# EAGLE design 006P-5V-3V3Supply (EAGLE 7.2.0)
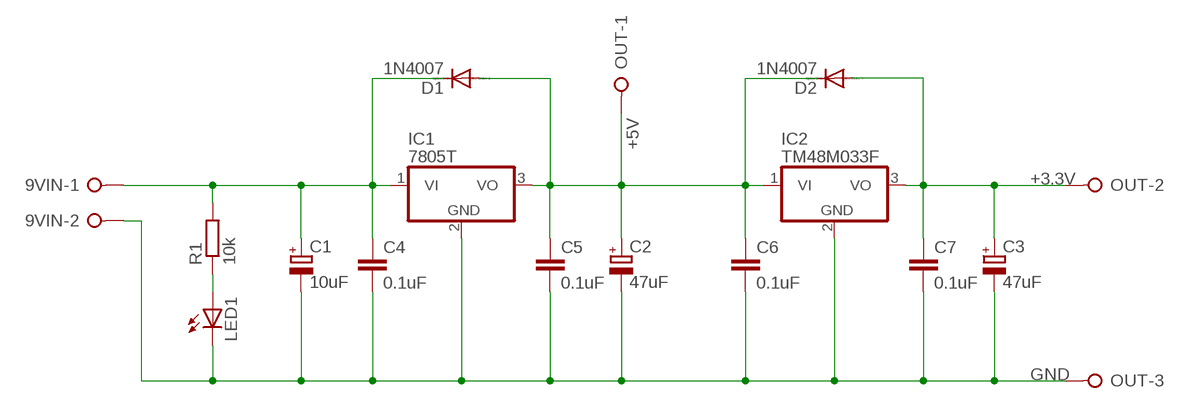
[diagram p0: schematic, sheet 1]

## Parts
9VIN  W237-02P  [W237-132]
C1  10uF  CPOL-EUTT2D4L  [TT2D4L]
C2  47uF  CPOL-EUTT2D5L  [TT2D5L]
C3  47uF  CPOL-EUTT2D5L  [TT2D5L]
C4  0.1uF  C-EU025-024X044  [C025-024X044]
C5  0.1uF  C-EU025-024X044  [C025-024X044]
C6  0.1uF  C-EU025-024X044  [C025-024X044]
C7  0.1uF  C-EU025-024X044  [C025-024X044]
D1  1N4007  1N4004  [DO41-10]
D2  1N4007  1N4004  [DO41-10]
IC1  7805T  [TO220H]
IC2  TM48M033F  7805TV  [TO220V]
LED1  LED3MM  [LED3MM]
OUT  W237-03P  [W237-133]
R1  10k  R-EU_0207/7  [0207/7]

## Nets
+3.3V: C3.+ C7.1 D2.A IC2.3(VO) OUT.2
+5V: C2.+ C5.1 C6.1 D1.A D2.C IC1.3(VO) IC2.1(VI) OUT.1
GND: 9VIN.2 C1.- C2.- C3.- C4.2 C5.2 C6.2 C7.2 IC1.2(GND) IC2.2(GND) LED1.K(C) OUT.3
IN9V: 9VIN.1 C1.+ C4.1 D1.C IC1.1(VI) R1.2
N$1: LED1.A R1.1

## Library data of the parts
9VIN = con-wago-508:W237-02P: WAGO SREW CLAMP; OC_FARNELL: unknown; OC_NEWARK: unknown
C1-C3 = rcl:CPOL-EU: POLARIZED CAPACITOR, European symbol
C4-C7 = rcl:C-EU: CAPACITOR, European symbol
D1 D2 = diode:1N4004: DIODE general purpose rectifier, 1 A
IC1 IC2 = linear:78*: Positive VOLTAGE REGULATOR Source: http://cache.national.com/ds/LM/LM78L05.pdf http://www.fairchildsemi.com/ds/LM/LM7805.pdf
LED1 = led:LED: LED OSRAM: - CHIPLED LG R971, LG N971, LY N971, LG Q971, LY Q971, LO R971, LY R971 LH N974, LH R974 LS Q976, LO Q976, LY Q976 LO Q996 - Hyper CHIPLED LW Q18S LB Q993, LB Q99A, LB R99A - SideLED LS A670, LO A670, LY A670, LG A670, LP A670 LB A673, LV A673, LT A673, LW A673 LH A674 LY A675 LS A676, LA A676, LO A676, LY A676, LW A676 LS A679, LY A679, LG A679 - Hyper Micro SIDELED® LS Y876, LA Y876, LO Y876, LY Y876 LT Y87S - SmartLED LW L88C, LW L88S LB L89C, LB L89S, LG L890 LS L89K, LO L89K, LY L89K LS L896, LA L896, LO L896, LY L896 - TOPLED LS T670, LO T670, LY T670, LG T670, LP T670 LSG T670, LSP T670, LSY T670, LOP T670, LYG T670 LG T671, LOG T671, LSG T671 LB T673, LV T673, LT T673, LW T673 LH T674 LS T676, LA T676, LO T676, LY T676, LB T676, LH T676, LSB T676, LW T676 LB T67C, LV T67C, LT T67C, LS T67K, LO T67K, LY T67K, LW E67C LS E67B, LA E67B, LO E67B, LY E67B, LB E67C, LV E67C, LT E67C LW T67C LS T679, LY T679, LG T679 LS T770, LO T770, LY T770, LG T770, LP T770 LB T773, LV T773, LT T773, LW T773 LH T774 LS E675, LA E675, LY E675, LS T675 LS T776, LA T776, LO T776, LY T776, LB T776 LHGB T686 LT T68C, LB T68C - Hyper Mini TOPLED® LB M676 - Mini TOPLED Santana® LG M470 LS M47K, LO M47K, LY M47K Source: http://www.osram.convergy.de LUXEON: - LUMILED® LXK2-PW12-R00, LXK2-PW12-S00, LXK2-PW14-U00, LXK2-PW14-V00 LXK2-PM12-R00, LXK2-PM12-S00, LXK2-PM14-U00 LXK2-PE12-Q00, LXK2-PE12-R00, LXK2-PE12-S00, LXK2-PE14-T00, LXK2-PE14-U00 LXK2-PB12-K00, LXK2-PB12-L00, LXK2-PB12-M00, LXK2-PB14-N00, LXK2-PB14-P00, LXK2-PB14-Q00 LXK2-PR12-L00, LXK2-PR12-M00, LXK2-PR14-Q00, LXK2-PR14-R00 LXK2-PD12-Q00, LXK2-PD12-R00, LXK2-PD12-S00 LXK2-PH12-R00, LXK2-PH12-S00 LXK2-PL12-P00, LXK2-PL12-Q00, LXK2-PL12-R00 Source: www.luxeon.com KINGBRIGHT: KA-3528ASYC Source: www.kingbright.com
OUT = con-wago-508:W237-03P: WAGO SREW CLAMP; OC_FARNELL: unknown; OC_NEWARK: unknown
R1 = rcl:R-EU_: RESISTOR, European symbol

## Board
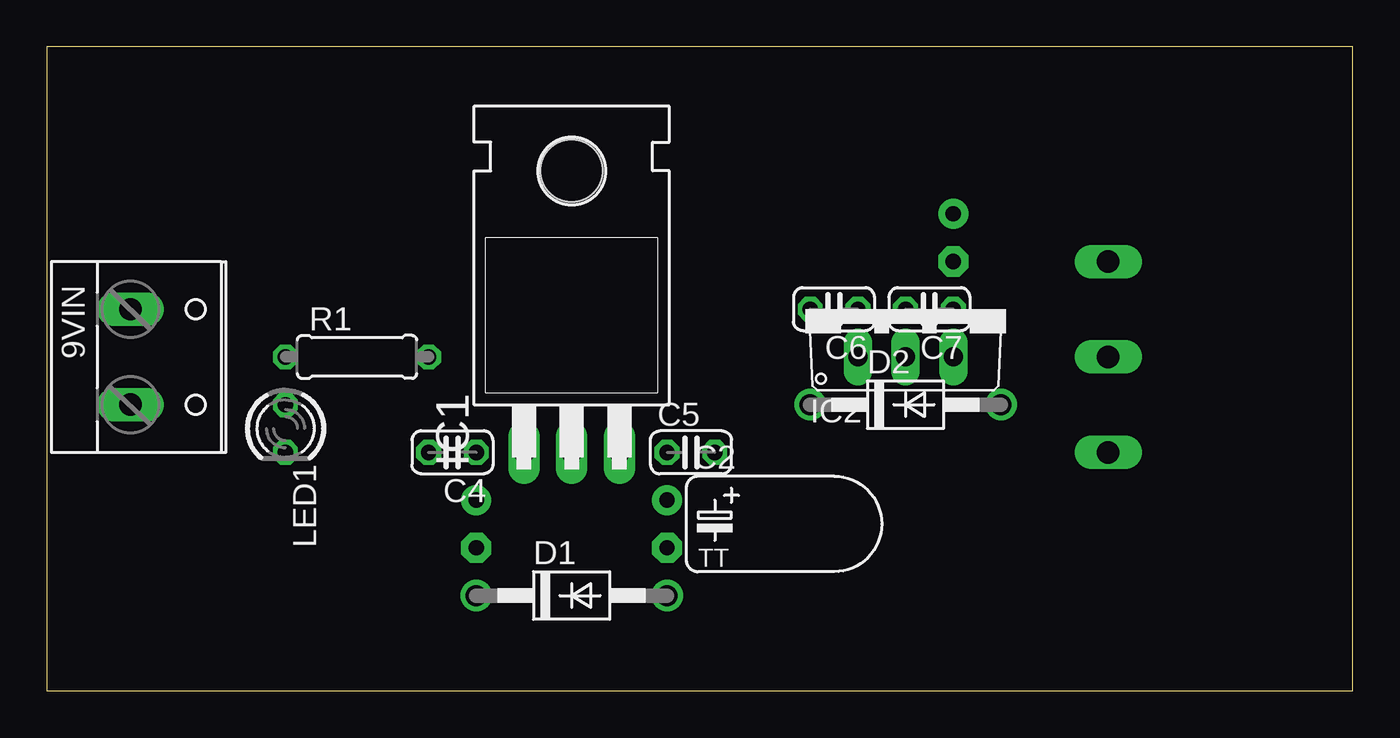
[diagram p1: board, top side]
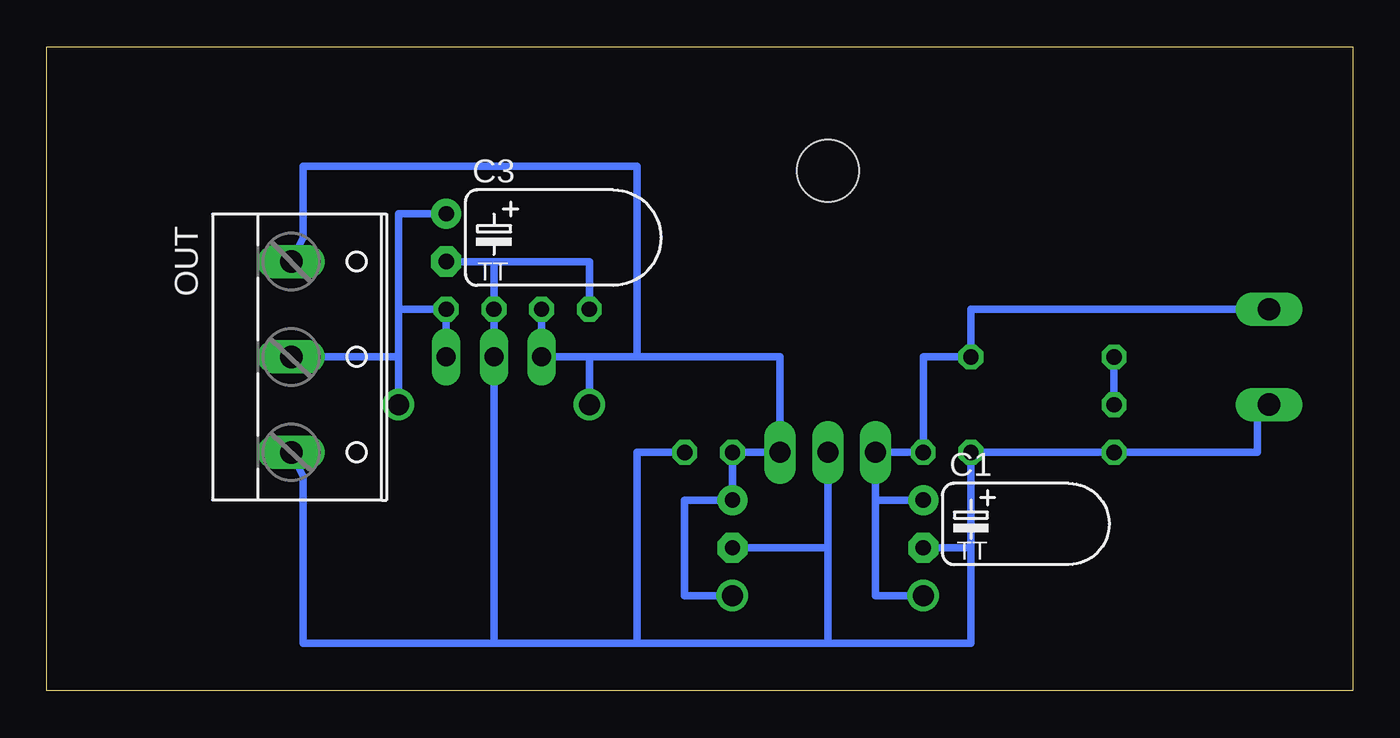
[diagram p2: board, bottom side, seen from below]

Size 69.52 x 34.28 mm. Coordinates in mm from the lower left corner, seen from the top.
Outline: 0,0 69.52,0 69.52,34.28 0,34.28 0,0
Copper layers (1*16): Top 0.035mm / dielectric 1.5mm / Bottom 0.035mm
Design rules "default": minimum track width 10mil, minimum drill 24mil, track to track 8mil, track to pad 8mil, pad to pad 8mil, via to via 8mil, smd to smd 8mil, copper to edge 40mil, drill to drill 8mil, minimum pad ring 10mil, minimum via ring 8mil, stop-mask expansion 4mil, vias tented up to drill 0mil, thermal gap 10mil

### Footprints (pad centres in the part's own frame; a part is rotated, then mirrored left to right if it is on the bottom)
W237-132 = drill 1.194 long: 1 -2.54,-0.635; 2 2.54,-0.635
TT2D4L = drill 0.813 pad 1.6: + -1.27,0 | drill 0.813 pad 1.6 octagon: - 1.27,0
TT2D5L = drill 0.813 pad 1.6: + -1.27,0 | drill 0.813 pad 1.6 octagon: - 1.27,0
C025-024X044 = drill 0.813 octagon: 1 -1.27,0; 2 1.27,0
DO41-10 = drill 1.118: A 5.08,0; C -5.08,0
TO220H = drill 1.118 long: 1 -2.54,-10.16; 2 0,-10.16; 3 2.54,-10.16 | hole 3.302: 0,4.826
TO220V = drill 1.016 long: 1 -2.54,-2.54; 2 0,-2.54; 3 2.54,-2.54
LED3MM = drill 0.813 octagon: A -1.27,0; K 1.27,0
W237-133 = drill 1.194 long: 1 -5.08,-0.635; 2 0,-0.635; 3 5.08,-0.635
0207/7 = drill 0.813 octagon: 1 -3.81,0; 2 3.81,0

### Placement (x,y rotation side)
9VIN  5.08,17.78 270 top
C1  22.86,8.89 270 bottom
C2  33.02,8.89 270 top
C3  48.26,24.13 270 bottom
C4  21.59,12.7 180 top
C5  34.29,12.7 0 top
C6  41.91,20.32 180 top
C7  46.99,20.32 180 top
D1  27.94,5.08 0 top
D2  45.72,15.24 0 top
IC1  27.94,22.86 0 top
IC2  45.72,20.32 0 top
LED1  12.7,13.97 270 top
OUT  55.88,17.78 270 bottom
R1  16.51,17.78 0 top

### Tracks (layer width: path | path; a pad name or v marks a point on that pad's centre or on a via)
+3.3V
  Bottom 0.406: 50.8,17.78 D2.A | 50.8,17.78 50.8,20.32 | 50.8,20.32 50.8,25.4 C3.+ | OUT.2 50.8,17.78 | IC2.3 C7.1 50.8,20.32
+5V
  Bottom 0.406: D1.A 35.56,5.08 35.56,10.16 C2.+ C5.1 IC1.3 30.48,17.78 38.1,17.78 | D2.C 40.64,17.78 | 40.64,17.78 38.1,17.78 | C6.1 IC2.1 40.64,17.78 | 38.1,17.78 38.1,27.94 55.88,27.94 55.88,24.13 OUT.1
GND
  Bottom 0.406: 9VIN.2 5.08,15.24 5.08,12.7 LED1.K C4.2 20.32,7.62 | 27.94,2.54 20.32,2.54 20.32,7.62 | 27.94,2.54 27.94,7.62 | 27.94,7.62 IC1.2 | C2.- 27.94,7.62 | 45.72,2.54 38.1,2.54 | 38.1,2.54 27.94,2.54 | 45.72,22.86 C7.2 IC2.2 45.72,2.54 | 45.72,22.86 40.64,22.86 C6.2 | C3.- 45.72,22.86 | OUT.3 55.88,11.43 55.88,2.54 45.72,2.54 | C1.- 20.32,7.62 | C5.2 38.1,12.7 38.1,2.54
IN9V
  Bottom 0.406: 9VIN.1 20.32,20.32 R1.2 22.86,17.78 C4.1 IC1.1 25.4,10.16 | C1.+ 25.4,10.16 | D1.C 25.4,5.08 25.4,10.16
N$1
  Bottom 0.406: LED1.A R1.1